# Altium project PCB_Project.PrjPcb
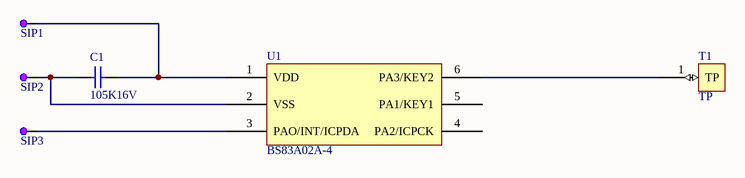
[diagram p0: touch.SchDoc]
1 sheet, 6 parts. Net scope: global (net labels, ports and power ports of the same name join across sheets).
Board file: touch.PcbDoc

## Sheet touch.SchDoc
size A4

### Parts
C1  105K16V  [C0603]
SIP1  SIP1  [SIP-2MM]  (value not drawn)
SIP2  SIP1  [SIP-2MM]  (value not drawn)
SIP3  SIP1  [SIP-2MM]  (value not drawn)
T1  TP  [touch 按键]
U1  BS83A02A-4  [U-SOT-23-6]

### Nets
NetC1_1: C1.1 SIP1.1 U1.1(VDD)
NetC1_2: C1.2 SIP2.1 U1.2(VSS)
NetSIP3_1: SIP3.1 U1.3(PAO/INT/ICPDA)
NetT1_1: T1.1(TP) U1.6(PA3/KEY2)

Not connected (* = marked no-connect by the designer): U1 4(PA2/ICPCK) 5(PA1/KEY1)

### Library data of the parts
C1 = C0603X7R-105K16V: 贴片电容-陶瓷; 规格型号: 1uF±10%_16V_X7R_C0603; 生产商: 风华 三星; 供应商: *; 备注: *
SIP1-SIP3 = SIP1: 单排排针，2.54mm针距，1P,针总长11.1mm,黑色; 单价: 0.002